# Altium schematic sheet DM2097_HUB.SchDoc: =project_title
size Tabloid; PageSetup: Record=PageOptions|CenterHorizontal=True|CenterVertical=True|PrintScale=0.73|XCorrection=1.00|YCorrection=1.00|PrintKind=0|BorderSize=5000000|LeftOffset=0|BottomOffset=0|Orientation=2|PaperLength=1000|PaperWidth=1000|Scale=100|PaperSource=7|PrintQuality=-4|MediaType=1|DitherType=10|PaperKind=A4|PrintScaleMode=1; CompanyName: Luxonis Holding; Organization: Luxonis Holding; Address1: 1925 Harmony Park Drive; Address2: Westminster, CO; Address3: 80234; Address4: United States; SheetNumber: 8; SheetTotal: 17
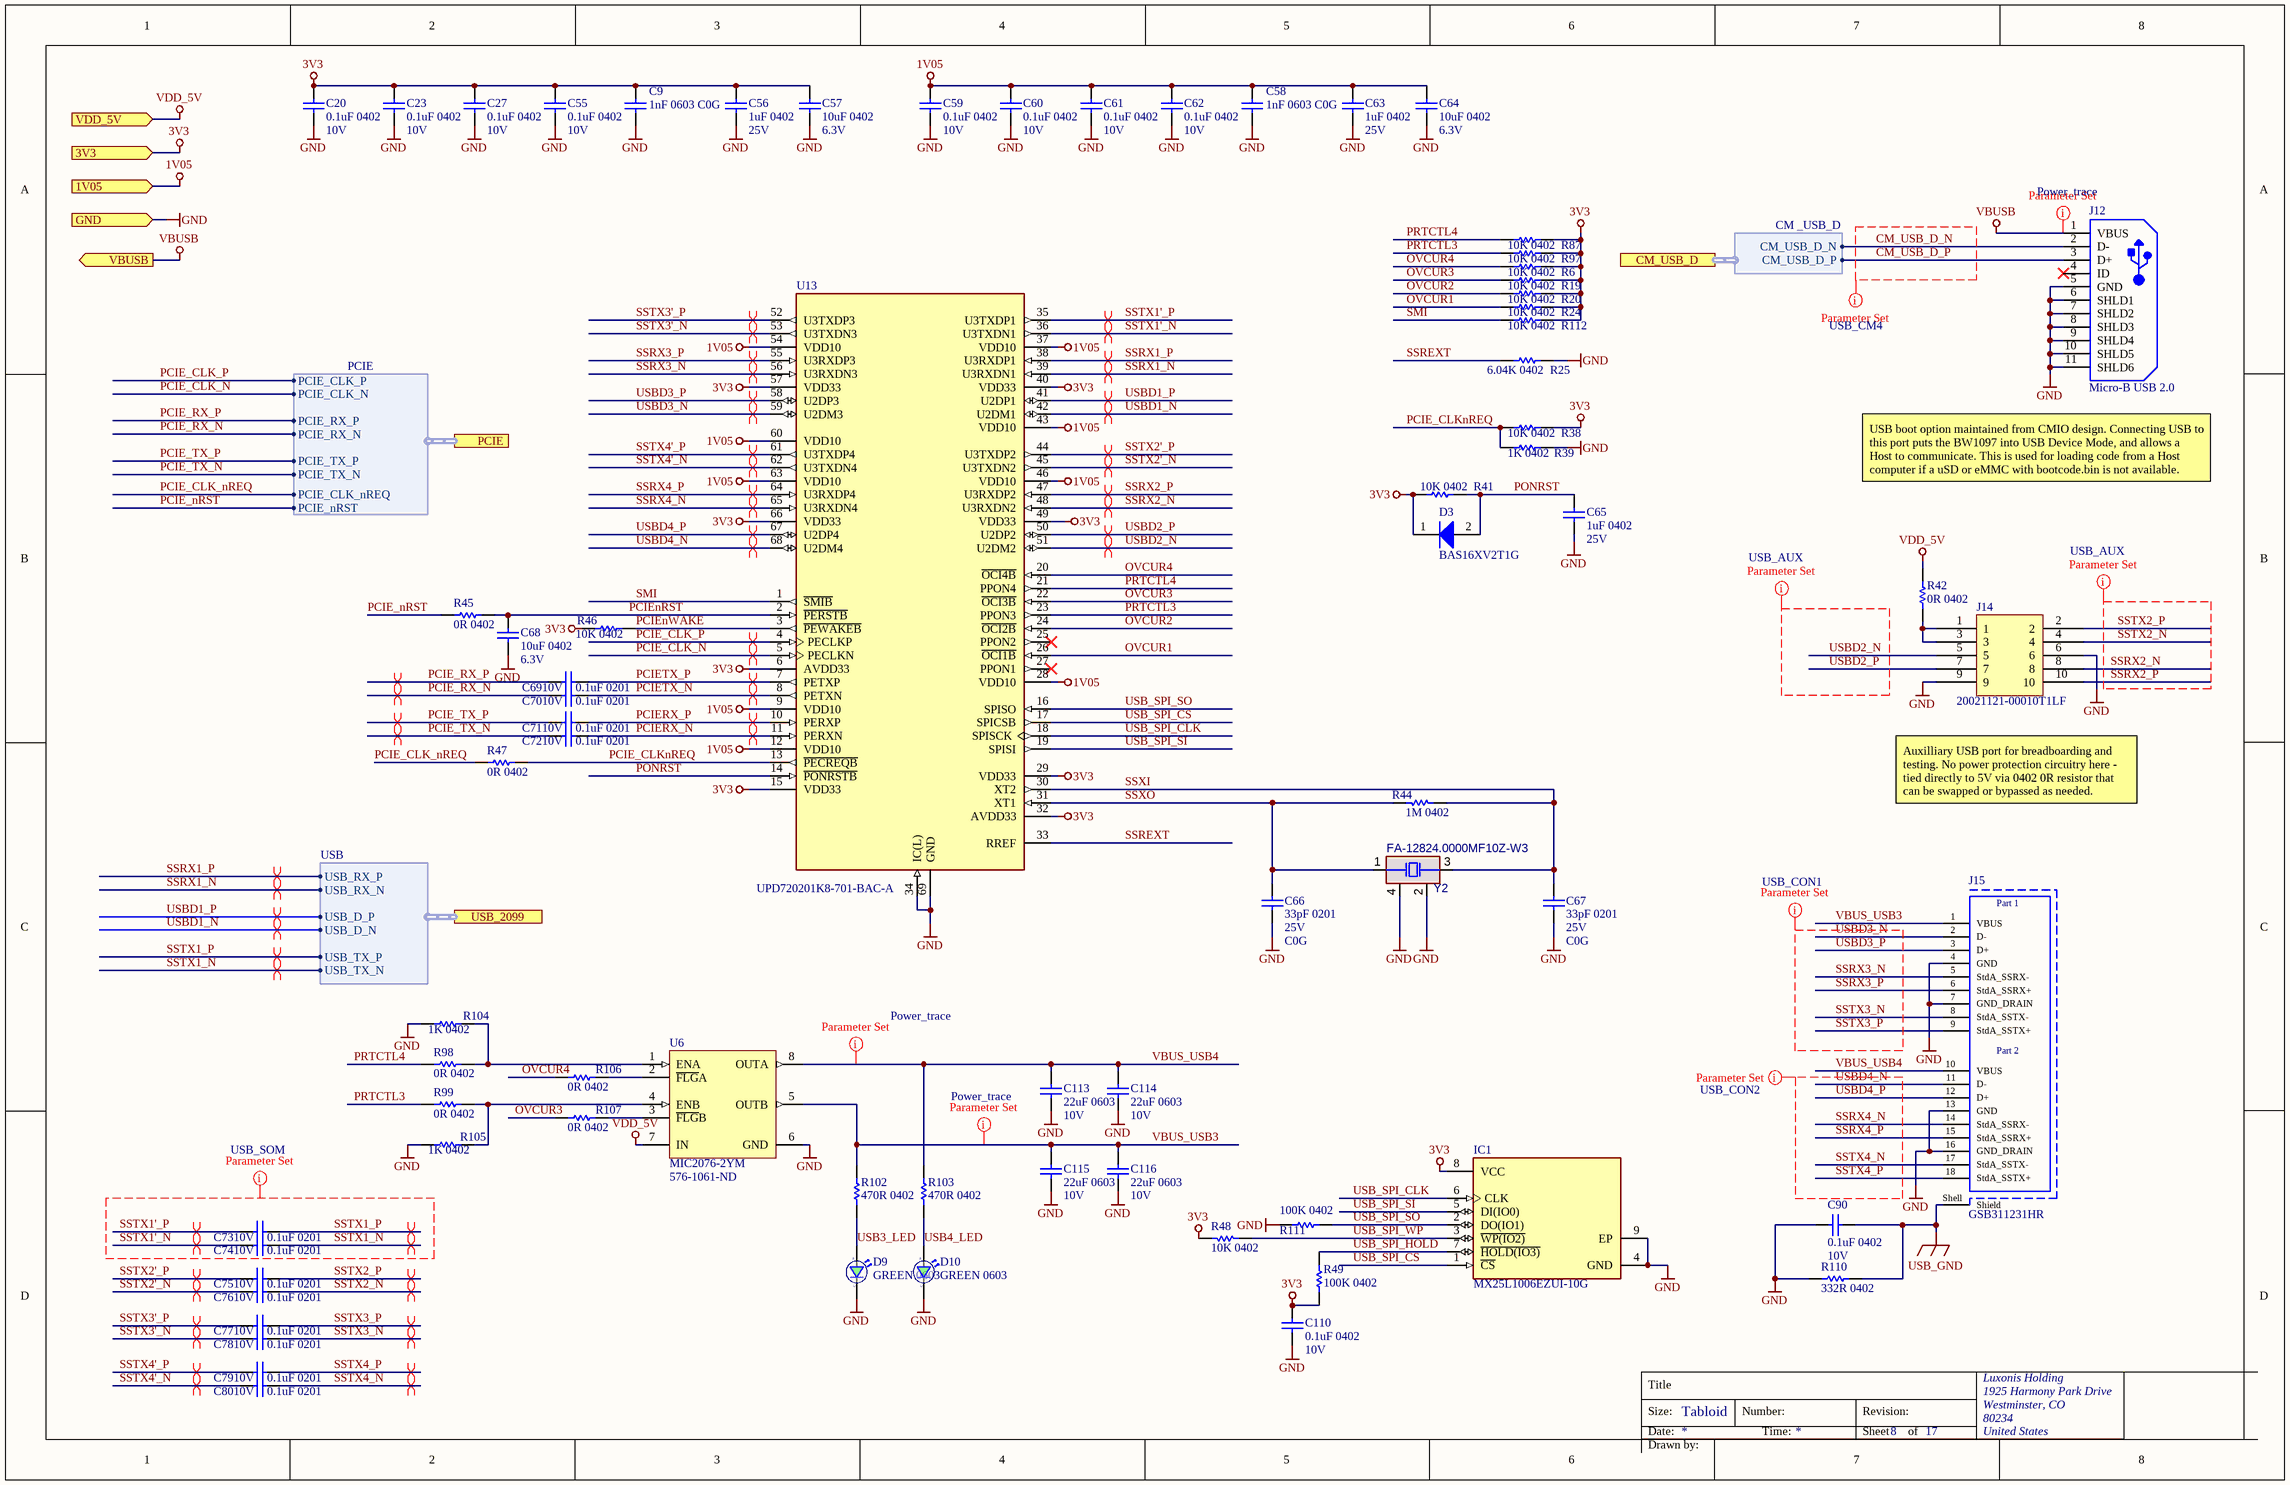
[diagram p0: DM2097_HUB.SchDoc]

## Parts
C9  1nF 0603 C0G  [CAPC0603(1608)100_N]
C20  0.1uF 0402  Voltage Rating: 10V  [CAPC0402(1005)70_N]
C23  0.1uF 0402  Voltage Rating: 10V  [CAPC0402(1005)70_N]
C27  0.1uF 0402  Voltage Rating: 10V  [CAPC0402(1005)70_N]
C55  0.1uF 0402  Voltage Rating: 10V  [CAPC0402(1005)70_N]
C56  1uF 0402  Voltage Rating: 25V  [CAPC0402(1005)70_N]
C57  10uF 0402  Voltage Rating: 6.3V  [CAPC0402(1005)70_N]
C58  1nF 0603 C0G  [CAPC0603(1608)100_N]
C59  0.1uF 0402  Voltage Rating: 10V  [CAPC0402(1005)70_N]
C60  0.1uF 0402  Voltage Rating: 10V  [CAPC0402(1005)70_N]
C61  0.1uF 0402  Voltage Rating: 10V  [CAPC0402(1005)70_N]
C62  0.1uF 0402  Voltage Rating: 10V  [CAPC0402(1005)70_N]
C63  1uF 0402  Voltage Rating: 25V  [CAPC0402(1005)70_N]
C64  10uF 0402  Voltage Rating: 6.3V  [CAPC0402(1005)70_N]
C65  1uF 0402  Voltage Rating: 25V  [CAPC0402(1005)70_N]
C66  33pF 0201  Voltage Rating: 25V  Dielectric: C0G  [CAPC0201(0603)33_L]
C67  33pF 0201  Voltage Rating: 25V  Dielectric: C0G  [CAPC0201(0603)33_L]
C68  10uF 0402  Voltage Rating: 6.3V  [CAPC0402(1005)70_N]
C69  0.1uF 0201  Voltage: 10V  [CAPC0201(0603)33_L]
C70  0.1uF 0201  Voltage: 10V  [CAPC0201(0603)33_L]
C71  0.1uF 0201  Voltage: 10V  [CAPC0201(0603)33_L]
C72  0.1uF 0201  Voltage: 10V  [CAPC0201(0603)33_L]
C73  0.1uF 0201  Voltage: 10V  [CAPC0201(0603)33_L]
C74  0.1uF 0201  Voltage: 10V  [CAPC0201(0603)33_L]
C75  0.1uF 0201  Voltage: 10V  [CAPC0201(0603)33_L]
C76  0.1uF 0201  Voltage: 10V  [CAPC0201(0603)33_L]
C77  0.1uF 0201  Voltage: 10V  [CAPC0201(0603)33_L]
C78  0.1uF 0201  Voltage: 10V  [CAPC0201(0603)33_L]
C79  0.1uF 0201  Voltage: 10V  [CAPC0201(0603)33_L]
C80  0.1uF 0201  Voltage: 10V  [CAPC0201(0603)33_L]
C90  0.1uF 0402  Voltage Rating: 10V  [CAPC0402(1005)70_N]
C110  0.1uF 0402  Voltage Rating: 10V  [CAPC0402(1005)70_N]
C113  22uF 0603  Voltage Rating: 10V  [CAPC0603(1608)100_N]
C114  22uF 0603  Voltage Rating: 10V  [CAPC0603(1608)100_N]
C115  22uF 0603  Voltage Rating: 10V  [CAPC0603(1608)100_N]
C116  22uF 0603  Voltage Rating: 10V  [CAPC0603(1608)100_N]
D3  BAS16XV2T1G  [BAS16XV2T1G]
D9  GREEN 0603  [SML_D1xx8W]
D10  GREEN 0603  [SML_D1xx8W]
IC1  MX25L1006EZUI-10G  [MX25L1006EZUI-10G-Footprint-1]
J12  Micro-B USB 2.0  [10118194-0001LF]
J14  20021121-00010T1LF  [20021121-00010T1LF]
J15  GSB311231HR  [GSB311231HR]
R6  10K 0402  [RESC0402(1005)_N]
R19  10K 0402  [RESC0402(1005)_N]
R20  10K 0402  [RESC0402(1005)_N]
R24  10K 0402  [RESC0402(1005)_N]
R25  6.04K 0402  [RESC0402(1005)_L]
R38  10K 0402  [RESC0402(1005)_N]
R39  1K 0402  [RESC0402(1005)_L]
R41  10K 0402  [RESC0402(1005)_N]
R42  0R 0402  [RESC0402(1005)_N]
R44  1M 0402  [RESC0402(1005)_N]
R45  0R 0402  [RESC0402(1005)_N]
R46  10K 0402  [RESC0402(1005)_N]
R47  0R 0402  [RESC0402(1005)_N]
R48  10K 0402  [RESC0402(1005)_N]
R49  100K 0402  [RESC0402(1005)_L]
R87  10K 0402  [RESC0402(1005)_N]
R97  10K 0402  [RESC0402(1005)_N]
R98  0R 0402  [RESC0402(1005)_N]
R99  0R 0402  [RESC0402(1005)_N]
R102  470R 0402  [RESC0402(1005)_N]
R103  470R 0402  [RESC0402(1005)_N]
R104  1K 0402  [RESC0402(1005)_L]
R105  1K 0402  [RESC0402(1005)_L]
R106  0R 0402  [RESC0402(1005)_N]
R107  0R 0402  [RESC0402(1005)_N]
R110  332R 0402  [RESC0402(1005)_N]
R111  100K 0402  [RESC0402(1005)_L]
R112  10K 0402  [RESC0402(1005)_N]
U6  MIC2076-2YM  Supplier Part Number 1: 576-1061-ND  [MIC2076-2YM]
U13  UPD720201K8-701-BAC-A  [QFN40P800X800X90-69N]
Y2  FA-12824.0000MF10Z-W3  [EPSON-FA-128_V]

## Ports
1V05 (in), 3V3 (in), CM_USB_D (harness CM _USB_D), GND (in), PCIE (harness PCIE), USB_2099 (harness USB), VBUSB (out), VDD_5V (in)

## Harnesses
CM _USB_D: CM_USB_D_P, CM_USB_D_N
PCIE: PCIE_CLK_P, PCIE_CLK_N, PCIE_RX_P, PCIE_RX_N, PCIE_TX_N, PCIE_TX_P, PCIE_CLK_nREQ, PCIE_nRST
USB: USB_D_P, USB_D_N, USB_TX_N, USB_TX_P, USB_RX_N, USB_RX_P

## Nets
1V05: C58.2 C59.2 C60.2 C61.2 C62.2 C63.2 C64.2 U13.9(VDD10) U13.12(VDD10) U13.28(VDD10) U13.37(VDD10) U13.43(VDD10) U13.46(VDD10) U13.54(VDD10) U13.60(VDD10) U13.63(VDD10) ; port 1V05
3V3: C9.2 C20.2 C23.2 C27.2 C55.2 C56.2 C57.2 C110.2 D3.1(K) IC1.8(VCC) R6.2 R19.2 R20.2 R24.2 R38.2 R41.1 R46.1 R48.2 R49.2 R87.2 R97.2 R112.2 U13.6(AVDD33) U13.15(VDD33) U13.29(VDD33) U13.32(AVDD33) U13.40(VDD33) U13.49(VDD33) U13.57(VDD33) U13.66(VDD33) ; port 3V3
GND: C9.1 C20.1 C23.1 C27.1 C55.1 C56.1 C57.1 C58.1 C59.1 C60.1 C61.1 C62.1 C63.1 C64.1 C65.1 C66.1 C67.1 C68.1 C90.1 C110.1 C113.2 C114.2 C115.2 C116.2 D9.1(C) D10.1(C) IC1.4(GND) IC1.9(EP) J12.5(GND) J12.6(SHLD1) J12.7(SHLD2) J12.8(SHLD3) J12.9(SHLD4) J12.10(SHLD5) J12.11(SHLD6) J14.6 J14.9 J15.4(GND) J15.7(GND_DRAIN) J15.13(GND) J15.16(GND_DRAIN) R25.2 R39.2 R104.1 R105.1 R110.1 R111.1 U6.6(GND) U13.34(IC(L)) U13.69(GND) Y2.2(NC) Y2.4(NC) ; port GND
USB_GND: C90.2 J15.Shell(Shield) R110.2
VBUSB: J12.1(VBUS) ; port VBUSB
VDD_5V: R42.2 U6.7(IN) ; port VDD_5V
CM_USB_D_N: J12.2(D-) ; port CM_USB_D.CM_USB_D_N
CM_USB_D_P: J12.3(D+) ; port CM_USB_D.CM_USB_D_P
OVCUR1: R24.1 U13.26(~{OCI1B})
OVCUR2: R20.1 U13.24(~{OCI2B})
OVCUR3: R19.1 R107.2 U13.22(~{OCI3B})
OVCUR4: R6.1 R106.2 U13.20(~{OCI4B})
PCIE_CLK_N: U13.5(PECLKN) ; port PCIE.PCIE_CLK_N
PCIE_CLK_nREQ: R47.1 ; port PCIE.PCIE_CLK_nREQ
PCIE_CLK_P: U13.4(PECLKP) ; port PCIE.PCIE_CLK_P
PCIE_CLKnREQ: R38.1 R39.1 R47.2 U13.13(~{PECREQB})
PCIE_nRST: R45.1 ; port PCIE.PCIE_nRST
PCIE_RX_N: C70.1 ; port PCIE.PCIE_RX_N
PCIE_RX_P: C69.1 ; port PCIE.PCIE_RX_P
PCIE_TX_N: C72.1 ; port PCIE.PCIE_TX_N
PCIE_TX_P: C71.1 ; port PCIE.PCIE_TX_P
PCIEnRST: C68.2 R45.2 U13.2(~{PERSTB})
PCIEnWAKE: R46.2 U13.3(~{PEWAKEB})
PCIERX_N: C72.2 U13.11(PERXN)
PCIERX_P: C71.2 U13.10(PERXP)
PCIETX_N: C70.2 U13.8(PETXN)
PCIETX_P: C69.2 U13.7(PETXP)
PONRST: C65.2 D3.2(A) R41.2 U13.14(~{PONRSTB})
PRTCTL3: R97.1 R99.2 U13.23(PPON3)
PRTCTL4: R87.1 R98.2 U13.21(PPON4)
SMI: R112.1 U13.1(~{SMIB})
SSREXT: R25.1 U13.33(RREF)
SSRX1_N: U13.39(U3RXDN1) ; port USB_2099.USB_RX_N
SSRX1_P: U13.38(U3RXDP1) ; port USB_2099.USB_RX_P
SSRX2_N: J14.8 U13.48(U3RXDN2)
SSRX2_P: J14.10 U13.47(U3RXDP2)
SSRX3_N: J15.5(StdA_SSRX-) U13.56(U3RXDN3)
SSRX3_P: J15.6(StdA_SSRX+) U13.55(U3RXDP3)
SSRX4_N: J15.14(StdA_SSRX-) U13.65(U3RXDN4)
SSRX4_P: J15.15(StdA_SSRX+) U13.64(U3RXDP4)
SSTX1'_N: C74.1 U13.36(U3TXDN1)
SSTX1'_P: C73.1 U13.35(U3TXDP1)
SSTX1_N: C74.2 ; port USB_2099.USB_TX_N
SSTX1_P: C73.2 ; port USB_2099.USB_TX_P
SSTX2'_N: C76.1 U13.45(U3TXDN2)
SSTX2'_P: C75.1 U13.44(U3TXDP2)
SSTX2_N: C76.2 J14.4
SSTX2_P: C75.2 J14.2
SSTX3'_N: C78.1 U13.53(U3TXDN3)
SSTX3'_P: C77.1 U13.52(U3TXDP3)
SSTX3_N: C78.2 J15.8(StdA_SSTX-)
SSTX3_P: C77.2 J15.9(StdA_SSTX+)
SSTX4'_N: C80.1 U13.62(U3TXDN4)
SSTX4'_P: C79.1 U13.61(U3TXDP4)
SSTX4_N: C80.2 J15.17(StdA_SSTX-)
SSTX4_P: C79.2 J15.18(StdA_SSTX+)
SSXI: C67.2 R44.1 U13.30(XT2) Y2.3(X2)
SSXO: C66.2 R44.2 U13.31(XT1) Y2.1(X1)
USB3_LED: D9.2(A) R102.1
USB4_LED: D10.2(A) R103.1
USB_SPI_CLK: IC1.6(CLK) U13.18(SPISCK)
USB_SPI_CS: IC1.1(~{CS}) U13.17(SPICSB)
USB_SPI_HOLD: IC1.7(~{HOLD(IO3)}) R49.1
USB_SPI_SI: IC1.5(DI(IO0)) U13.19(SPISI)
USB_SPI_SO: IC1.2(DO(IO1)) R111.2 U13.16(SPISO)
USB_SPI_WP: IC1.3(~{WP(IO2)}) R48.1
USBD1_N: U13.42(U2DM1) ; port USB_2099.USB_D_N
USBD1_P: U13.41(U2DP1) ; port USB_2099.USB_D_P
USBD2_N: J14.5 U13.51(U2DM2)
USBD2_P: J14.7 U13.50(U2DP2)
USBD3_N: J15.2(D-) U13.59(U2DM3)
USBD3_P: J15.3(D+) U13.58(U2DP3)
USBD4_N: J15.11(D-) U13.68(U2DM4)
USBD4_P: J15.12(D+) U13.67(U2DP4)
VBUS_USB3: C115.1 C116.1 J15.1(VBUS) R102.2 U6.5(OUTB)
VBUS_USB4: C113.1 C114.1 J15.10(VBUS) R103.2 U6.8(OUTA)
NetJ14_1: J14.1 J14.3 R42.1
NetR98_1: R98.1 R104.2 U6.1(ENA)
NetR99_1: R99.1 R105.2 U6.4(ENB)
NetR106_1: R106.1 U6.2(~{FLG}A)
NetR107_1: R107.1 U6.3(~{FLG}B)

Not connected (* = marked no-connect by the designer): J12 4(ID)*; U13 25(PPON2)* 27(PPON1)*

## Layout directives
net class Power_trace: VBUS_USB3, VBUS_USB4, VBUSB
differential pair; differential pair class 90ohm: SSRX1_N, SSRX1_P, SSRX2_N, SSRX2_P, SSRX3_N, SSRX3_P, SSRX4_N, SSRX4_P, SSTX1'_N, SSTX1'_P, SSTX1_N, SSTX1_P, SSTX2'_N, SSTX2'_P, SSTX2_N, SSTX2_P, SSTX3'_N, SSTX3'_P, SSTX3_N, SSTX3_P, SSTX4'_N, SSTX4'_P, SSTX4_N, SSTX4_P, USBD1_N, USBD1_P, USBD2_N, USBD2_P, USBD3_N, USBD3_P, USBD4_N, USBD4_P
differential pair; differential pair class 100ohm: PCIE_CLK_N, PCIE_CLK_P, PCIE_RX_N, PCIE_RX_P, PCIE_TX_N, PCIE_TX_P, PCIERX_N, PCIERX_P, PCIETX_N, PCIETX_P
net class USB_CON2: SSRX4_N, SSRX4_P, SSTX4_N, SSTX4_P, USBD4_N, USBD4_P
net class USB_CON1: SSRX3_N, SSRX3_P, SSTX3_N, SSTX3_P, USBD3_N, USBD3_P
net class USB_AUX: SSRX2_N, SSRX2_P, SSTX2_N, SSTX2_P, USBD2_N, USBD2_P
net class USB_CM4: CM_USB_D_N, CM_USB_D_P
net class USB_SOM: SSTX1'_N, SSTX1'_P, SSTX1_N, SSTX1_P

## Notes on the sheet
- (near J12) USB boot option maintained from CMIO design. Connecting USB to this port puts the BW1097 into USB Device Mode, and allows a Host to communicate. This is used for loading code from a Host computer if a uSD or eMMC with bootcode.bin is not available.
- Auxilliary USB port for breadboarding and testing. No power protection circuitry here - tied directly to 5V via 0402 0R resistor that can be swapped or bypassed as needed.
- Title
- Size:
- Date:
- Tabloid
- Number:
- Time:
- Revision:
- Sheet
- of
- Drawn by:
- (in symbol GSB311231HR) Part 1; Part 2

## Library data of the parts
C9 C58 = GRM1885C1H102FA01D: CAP CER 1000PF 50V C0G/NP0 0603; Manufacturer: Murata; Material: Ceramic; Tolerance: 1%; Temperature Coefficient: 30ppm/°C; Manufacturer Part Number: GRM1885C1H102FA01D; RoHS: Yes; Mount: Surface Mount; Number of Pins: 2; Case Code (Metric): 1608; Case Code (Imperial): 0603; Min Operating Temperature: -55°C; Max Operating Temperature: 125°C; Packaging: Tape and Reel; Package Quantity: 4000; Termination: SMD/SMT; Voltage Rating (DC): 50V; Voltage: 50V; Length: 1.6mm; Height: 0.8mm; Width: 0.031inch; Thickness: 0.035inch; Depth: 0.8mm; Radiation Hardening: No; REACH SVHC: No SVHC; Lead Free: Lead Free; ComponentLink1URL: https://datasheet.ciiva.com/6072/1747444-6072454.pdf?src-supplier=Farnell; ComponentLink1Description: https://datasheet.ciiva.com/6072/1747444-6072454.pdf?src-supplier=Farnell; ComponentLink2URL: https://datasheet.ciiva.com/7828/1747444-7828892.pdf?src-supplier=Element14; ComponentLink2Description: https://datasheet.ciiva.com/7828/1747444-7828892.pdf?src-supplier=Element14; ComponentLink3URL: https://datasheet.ciiva.com/11621/c02e-11621692.pdf?src-supplier=Avnet; ComponentLink3Description: https://datasheet.ciiva.com/11621/c02e-11621692.pdf?src-supplier=Avnet; ComponentLink4URL: https://datasheet.ciiva.com/16624/c02e-16624140.pdf?src-supplier=Avnet+Europe; ComponentLink4Description: https://datasheet.ciiva.com/16624/c02e-16624140.pdf?src-supplier=Avnet+Europe; ComponentLink5URL: https://datasheet.ciiva.com/22698/1747444-22698428.pdf?src-supplier=Element14; ComponentLink5Description: https://datasheet.ciiva.com/22698/1747444-22698428.pdf?src-supplier=Element14; ComponentLink6URL: https://datasheet.ciiva.com/5416/c02e-5416637.pdf?src-supplier=Mouser; ComponentLink6Description: https://datasheet.ciiva.com/5416/c02e-5416637.pdf?src-supplier=Mouser; ComponentLink7URL: https://datasheet.ciiva.com/6270/partnumbering-e-01-6270573.pdf?src-supplier=Digi-Key; ComponentLink7Description: https://datasheet.ciiva.com/6270/partnumbering-e-01-6270573.pdf?src-supplier=Digi-Key; ComponentLink8URL: https://datasheet.ciiva.com/6270/partnumbering-e-01-6270574.pdf?src-supplier=Digi-Key; ComponentLink8Description: https://datasheet.ciiva.com/6270/partnumbering-e-01-6270574.pdf?src-supplier=Digi-Key; ComponentLink9URL: https://datasheet.ciiva.com/6270/partnumbering-e-01-6270575.pdf?src-supplier=Digi-Key; ComponentLink9Description: https://datasheet.ciiva.com/6270/partnumbering-e-01-6270575.pdf?src-supplier=Digi-Key; ComponentLink10URL: https://datasheet.ciiva.com/16426/l0005e-16426367.pdf?src-supplier=Future+Electronics; ComponentLink10Description: https://datasheet.ciiva.com/16426/l0005e-16426367.pdf?src-supplier=Future+Electronics; Supplier 1: Digi-Key; Manufacturer 1: Murata; Manufacturer Part Number 1: GRM1885C1H102FA01D; Stock 1: 343900; Pricing 1: 1=0.19000, 10=0.13300, 100=0.06260, 500=0.04386, 1000=0.03631 (USD); Case/Package: 0603; Capacitance: 1nF; Dielectric: C0G; Voltage Rating: 50V; Supplier Part Number 1: 490-6376-1-ND
C20 C23 C27 C55 C59-C62 C90 C110 = GRM155R71A104JA01D: CAP CER 0.1UF 10V X7R 0402 5%; Manufacturer 1: Murata; Capacitance: 100nF; Supplier 1: Digi-Key; Manufacturer Part Number 1: GRM155R71A104JA01D; Stock 1: 1346709; Pricing 1: 1=0.10000, 10=0.02500, 100=0.01130, 500=0.00806, 1000=0.00633, 2500=0.00575, 5000=0.00529 (USD); RoHS: Yes; Mount: Surface Mount; Case/Package: 0402; Case Code (Imperial): 0402; Case Code (Metric): 1005; Min Operating Temperature: -55°C; Max Operating Temperature: 125°C; Tolerance: 5%; Packaging: Tape and Reel; Voltage Rating (DC): 10V; Dielectric: X7R; Package Quantity: 10000; Termination: SMD/SMT; Length: 1mm; Height: 0.5mm; Width: 0.02inch; Thickness: 0.022inch; Depth: 0.5mm; Radiation Hardening: No; Lead Free: Lead Free; ComponentLink1URL: https://datasheet.ciiva.com/5411/product-5411135.pdf?src-supplier=Mouser; ComponentLink1Description: https://datasheet.ciiva.com/5411/product-5411135.pdf?src-supplier=Mouser; ComponentLink2URL: https://datasheet.ciiva.com/11618/c02e-11618821.pdf?src-supplier=Avnet; ComponentLink2Description: https://datasheet.ciiva.com/11618/c02e-11618821.pdf?src-supplier=Avnet; Supplier Part Number 1: 490-10777-1-ND
C56 C63 C65 = GRM155R61E105KA12D: CAP CER 1UF 25V X5R 0402 10%; Manufacturer 1: Murata; Material: Ceramic; Supplier 1: Digi-Key; Manufacturer Part Number 1: GRM155R61E105KA12D; Stock 1: 200653; Pricing 1: 1=0.10000, 10=0.07100, 100=0.03350, 500=0.02352, 1000=0.01947, 2500=0.01812, 5000=0.01658 (USD); RoHS: Yes; Mount: Surface Mount; Case/Package: 0402; Weight: 0.000212oz; Case Code (Metric): 1005; Case Code (Imperial): 0402; Min Operating Temperature: -55°C; Max Operating Temperature: 85°C; Tolerance: 10%; Capacitance: 1uF; Dielectric: X5R; Voltage Rating (DC): 25V; Packaging: Tape and Reel; Package Quantity: 10000; Termination: SMD/SMT; Voltage: 25V; Length: 1mm; Height: 0.5mm; Width: 0.5mm; Thickness: 0.022inch; Depth: 0.5mm; Lead Free: Lead Free; REACH SVHC: No SVHC; ComponentLink1URL: https://datasheet.ciiva.com/22732/1666664-22732122.pdf?src-supplier=Element14; ComponentLink1Description: https://datasheet.ciiva.com/22732/1666664-22732122.pdf?src-supplier=Element14; ComponentLink2URL: https://datasheet.ciiva.com/7719/1666664-7719006.pdf?src-supplier=Element14; ComponentLink2Description: https://datasheet.ciiva.com/7719/1666664-7719006.pdf?src-supplier=Element14; Supplier Part Number 1: 490-10017-1-ND; Supplier 2: Arrow; Supplier 3: TTI; Supplier Part Number 2: GRM155R61E105KA12D; Supplier Part Number 3: GRM155R61E105KA12D
C57 C64 C68 = GRM155R60J106ME15D: CAP CER 10UF 6.3V X5R 0402 20%; Manufacturer 1: Murata; Supplier 1: Digi-Key; Manufacturer Part Number 1: GRM155R60J106ME15D; Stock 1: 1839627; Pricing 1: 1=0.23000, 10=0.15700, 100=0.07950, 500=0.05442, 1000=0.04814, 2500=0.04605, 5000=0.04186 (USD); RoHS: Yes; Mount: Surface Mount; Case/Package: 0402; Case Code (Metric): 1005; Case Code (Imperial): 0402; Min Operating Temperature: -55°C; Max Operating Temperature: 85°C; Packaging: Tape and Reel; Capacitance: 10uF; Dielectric: X5R; Length: 0.039inch; Width: 0.02inch; ComponentLink1URL: https://www.murata.com/~/media/webrenewal/support/library/catalog/products/capacitor/mlcc/c02e.ashx?la=en-us&src-supplier=Digi-Key; ComponentLink1Description: https://www.murata.com/~/media/webrenewal/support/library/catalog/products/capacitor/mlcc/c02e.ashx?la=en-us&src-supplier=Digi-Key; Supplier Part Number 1: 490-13238-1-ND; Voltage Rating (DC): 6.3V; Thickness: 0.026inch; Tolerance: 20%
C66 C67 = GRM0335C1E330JA01D: CAP CER 33PF 25V C0G/NP0 0201; Manufacturer 1: Murata; Tolerance: 5%; Manufacturer Part Number 1: GRM0335C1E330JA01D; Supplier 1: Digi-Key; Stock 1: 1107200; Pricing 1: 1=0.10000, 10=0.01500, 100=0.00680, 500=0.00484, 1000=0.00380, 2500=0.00345, 5000=0.00317 (USD); RoHS: Yes; Mount: Surface Mount; Case/Package: 0201; Case Code (Metric): 0603; Case Code (Imperial): 0201; Min Operating Temperature: -55°C; Max Operating Temperature: 125°C; Capacitance: 33pF; Packaging: Tape and Reel; Package Quantity: 15000; Voltage Rating (DC): 25V; Termination: SMD/SMT; Length: 0.6mm; Height: 0.3mm; Width: 0.012inch; Thickness: 0.013inch; Depth: 0.3mm; REACH SVHC: No SVHC; Lead Free: Lead Free; ComponentLink1URL: https://datasheet.ciiva.com/29538/partnumbering-e-01-29538933.pdf?src-supplier=Digi-Key; ComponentLink1Description: https://datasheet.ciiva.com/29538/partnumbering-e-01-29538933.pdf?src-supplier=Digi-Key; Supplier 2: Mouser; Supplier Part Number 2: 81-GRM0335C1E330JA1D; Supplier Part Number 1: 490-10678-1-ND
C69-C80 = GRM033R61A104KE15D: CAP CER 0.1UF 10V X5R 0201; Manufacturer 1: Murata; Capacitance: 100nF; Tolerance: 10%; Supplier 1: Digi-Key; Manufacturer Part Number 1: GRM033R61A104KE15D; Stock 1: 45335312; Pricing 1: 1=0.10000, 10=0.04200, 100=0.01860, 500=0.01330, 1000=0.01045, 2500=0.00950, 5000=0.00874 (USD); RoHS: Yes; Mount: Surface Mount; Case/Package: 0201; Weight: 6E-06oz; Case Code (Metric): 0603; Case Code (Imperial): 0201; Min Operating Temperature: -55°C; Max Operating Temperature: 85°C; Packaging: Tape and Reel; Voltage Rating: 10V; Package Quantity: 1; Voltage Rating (DC): 10V; Dielectric: X5R; Termination: SMD/SMT; Length: 0.6mm; Height: 0.3mm; Width: 0.012inch; Thickness: 0.013inch; Depth: 0.3mm; Radiation Hardening: No; Lead Free: Lead Free; REACH SVHC: No SVHC; ComponentLink1URL: https://datasheet.ciiva.com/26843/getdatasheetpartid-308656-26843739.pdf?src-supplier=Verical; ComponentLink1Description: https://datasheet.ciiva.com/26843/getdatasheetpartid-308656-26843739.pdf?src-supplier=Verical; ComponentLink2URL: https://datasheet.ciiva.com/5413/product-5413117.pdf?src-supplier=Mouser; ComponentLink2Description: https://datasheet.ciiva.com/5413/product-5413117.pdf?src-supplier=Mouser; ComponentLink3URL: https://datasheet.ciiva.com/6256/partnumbering-e-01-6256406.pdf?src-supplier=Digi-Key; ComponentLink3Description: https://datasheet.ciiva.com/6256/partnumbering-e-01-6256406.pdf?src-supplier=Digi-Key; ComponentLink4URL: https://datasheet.ciiva.com/6256/partnumbering-e-01-6256407.pdf?src-supplier=Digi-Key; ComponentLink4Description: https://datasheet.ciiva.com/6256/partnumbering-e-01-6256407.pdf?src-supplier=Digi-Key; ComponentLink5URL: https://datasheet.ciiva.com/6256/partnumbering-e-01-6256408.pdf?src-supplier=Digi-Key; ComponentLink5Description: https://datasheet.ciiva.com/6256/partnumbering-e-01-6256408.pdf?src-supplier=Digi-Key; Supplier Part Number 1: 490-5881-1-ND
C113-C116 = GRM188R61A226ME15D: CAP CER 22UF 10V X5R 0603 20%; Manufacturer 1: Murata; Material: Ceramic; Manufacturer Part Number 1: GRM188R61A226ME15D; ComponentLink1URL: https://datasheet.ciiva.com/46444/1769893-46444975.pdf?src-supplier=Element14; ComponentLink1Description: https://datasheet.ciiva.com/46444/1769893-46444975.pdf?src-supplier=Element14; Supplier 1: Digi-Key; Stock 1: 984716; Pricing 1: 1=0.31000, 10=0.21500, 100=0.12160, 500=0.08584, 1000=0.07512 (USD); RoHS: Yes; Mount: Surface Mount; Case/Package: 0603; Weight: 0.000222oz; Case Code (Metric): 1608; Case Code (Imperial): 0603; Min Operating Temperature: -55°C; Max Operating Temperature: 85°C; Capacitance: 22uF; Tolerance: 20%; Packaging: Tape and Reel; Dielectric: X5R; Voltage Rating (DC): 10V; Termination: SMD/SMT; Package Quantity: 4000; Length: 1.6mm; Height: 0.8mm; Width: 0.8mm; Thickness: 0.039inch; Depth: 0.8mm; REACH SVHC: No SVHC; Lead Free: Lead Free; Supplier Part Number 1: 490-10476-1-ND
D3 = CMP-004-00003-1: DIODE GEN PURP 75V 200MA SOD523; Manufacturer 1: ON Semiconductor; Max Surge Current: 500mA; Element Configuration: Single; Capacitance: 2pF; Power Dissipation: 200mW; Peak Reverse Current: 1uA; Reverse Recovery Time: 6ns; Forward Voltage: 1.25V; Polarity: Standard; ComponentLink6URL: https://datasheet.ciiva.com/16475/bas16xv2t1-d-16475723.pdf?src-supplier=Avnet+Asia; ComponentLink5Description: https://datasheet.ciiva.com/15144/getdatasheetpartid-84399-15144565.pdf?src-supplier=Verical; Stock 2: 246371; Peak Non-Repetitive Surge Current: 500mA; ComponentLink6Description: https://datasheet.ciiva.com/16475/bas16xv2t1-d-16475723.pdf?src-supplier=Avnet+Asia; ComponentLink3Description: https://datasheet.ciiva.com/22663/1708232-22663646.pdf?src-supplier=Element14; Contact Plating: Tin,Matte; Length: 1.3mm; Manufacturer Part Number 1: BAS16XV2T1G; Packaging: Tape and Reel; Stock 1: 246371; Lead Free: Lead Free; Width: 0.9mm; Max Forward Surge Current (Ifsm): 500mA; Halogen Free: Halogen Free; ComponentLink4Description: https://datasheet.ciiva.com/36525/806485-36525908.pdf?src-supplier=Jameco; Source: LuxonisMaster.SchLib; Package Quantity: 1; ComponentLink3URL: https://datasheet.ciiva.com/22663/1708232-22663646.pdf?src-supplier=Element14; Output Current: 200mA; Case/Package: SOD-523-2; Height: 0.7mm; ComponentLink5URL: https://datasheet.ciiva.com/15144/getdatasheetpartid-84399-15144565.pdf?src-supplier=Verical; Min Operating Temperature: -55°C; REACH SVHC: No SVHC; ComponentLink4URL: https://datasheet.ciiva.com/36525/806485-36525908.pdf?src-supplier=Jameco; Radiation Hardening: No; Max Reverse Voltage (DC): 75V; ComponentLink7Description: https://datasheet.ciiva.com/25930/bas16xv2t1-d-25930683.pdf?src-supplier=Avnet+Europe; Design Item ID: BAS16XV2T1G; Max Operating Temperature: 150°C; ComponentLink2URL: https://datasheet.ciiva.com/4434/bas16xv2t1-d-103464-4434928.pdf?src-supplier=Mouser; Forward Current: 200mA; Max Reverse Leakage Current: 1uA; Average Rectified Current: 200mA; ComponentLink1Description: https://datasheet.ciiva.com/915/bas16xv2t1-d-915360.pdf?src-supplier=Digi-Key; Pins: 2; Manufacturer Part Number 2: BAS16XV2T1G; Max Repetitive Reverse Voltage (Vrrm): 75V; ComponentLink2Description: https://datasheet.ciiva.com/4434/bas16xv2t1-d-103464-4434928.pdf?src-supplier=Mouser; ComponentLink7URL: https://datasheet.ciiva.com/25930/bas16xv2t1-d-25930683.pdf?src-supplier=Avnet+Europe; Pricing 2: 1=0.13000, 10=0.11600, 100=0.06330, 500=0.03898, 1000=0.02658 (USD); ComponentLink1URL: https://datasheet.ciiva.com/915/bas16xv2t1-d-915360.pdf?src-supplier=Digi-Key; Recovery Time: 6ns; Manufacturer 2: ON Semiconductor; Pricing 1: 1=0.13000, 10=0.11600, 100=0.06330, 500=0.03898, 1000=0.02658 (USD); RoHS: Yes
D9 D10 = SML-D12M8WT86: LED GREEN DIFFUSED 0603 SMD Green 572nm LED Indication - Discrete 2.2V 0603 (1608 Metric); Manufacturer: Rohm; Colour: Green,Yellow; Lens Colour: White,Clear,Diffused; Lens Style: Diffused,Colorless,Rectangular; Forward Current: 20mA; Luminous Intensity: 25mcd; Number of LEDs: 1; Viewing Angle: 160°; Lens Color: White,Diffused; Supplier 1: Digi-Key; Manufacturer Part Number: SML-D12M8WT86; Stock 1: 112971; Pricing 1: 1=0.33000, 10=0.23900, 100=0.11340, 500=0.07560, 1000=0.05922 (USD); Mount: Surface Mount; Case/Package: 0603; Number of Pins: 2; Case Code (Metric): 1608; Case Code (Imperial): 0603; Min Operating Temperature: -40°C; Max Operating Temperature: 85°C; Forward Voltage: 2.2V; Packaging: Tape and Reel; Dominant Wavelength: 572nm; Wavelength: 572nm; Illumination Colour: Green; Package Quantity: 1; Test Current: 20mA; Lens Transparency: Diffused; Length: 1.6mm; Height: 0.65mm; Width: 0.8mm; Radiation Hardening: No; REACH SVHC: Unknown; Lead Free: Lead Free; ComponentLink1URL: https://datasheet.ciiva.com/11774/0900766b80df3ada-11774260.pdf; ComponentLink1Description: https://datasheet.ciiva.com/11774/0900766b80df3ada-11774260.pdf; ComponentLink2URL: https://datasheet.ciiva.com/3161/sml-d1-3161419.pdf; ComponentLink2Description: https://datasheet.ciiva.com/3161/sml-d1-3161419.pdf; ComponentLink3URL: https://datasheet.ciiva.com/2110/sml-d1-2110396.pdf; ComponentLink3Description: https://datasheet.ciiva.com/2110/sml-d1-2110396.pdf; ComponentLink4URL: https://datasheet.ciiva.com/2110/sml-d1-2110397.pdf; ComponentLink4Description: https://datasheet.ciiva.com/2110/sml-d1-2110397.pdf; ComponentLink5URL: https://datasheet.ciiva.com/2110/sml-d1-2110398.pdf; ComponentLink5Description: https://datasheet.ciiva.com/2110/sml-d1-2110398.pdf; Manufacturer 1: Rohm; Manufacturer Part Number 1: SML-D12M8WT86; RoHS: Yes; Color: Green,Yellow; Illumination Color: Green; ComponentLink6URL: https://datasheet.ciiva.com/11774/0900766b80df3ada-11774260.pdf?src-supplier=RSComponents; ComponentLink6Description: https://datasheet.ciiva.com/11774/0900766b80df3ada-11774260.pdf?src-supplier=RSComponents; ComponentLink7URL: https://datasheet.ciiva.com/3161/sml-d1-3161419.pdf?src-supplier=Avnet; ComponentLink7Description: https://datasheet.ciiva.com/3161/sml-d1-3161419.pdf?src-supplier=Avnet; ComponentLink8URL: https://datasheet.ciiva.com/2110/sml-d1-2110396.pdf?src-supplier=Digi-Key; ComponentLink8Description: https://datasheet.ciiva.com/2110/sml-d1-2110396.pdf?src-supplier=Digi-Key; ComponentLink9URL: https://datasheet.ciiva.com/2110/sml-d1-2110397.pdf?src-supplier=Digi-Key; ComponentLink9Description: https://datasheet.ciiva.com/2110/sml-d1-2110397.pdf?src-supplier=Digi-Key; ComponentLink10URL: https://datasheet.ciiva.com/2110/sml-d1-2110398.pdf?src-supplier=Digi-Key; ComponentLink10Description: https://datasheet.ciiva.com/2110/sml-d1-2110398.pdf?src-supplier=Digi-Key; Supplier Part Number 1: 511-1578-1-ND
IC1 = CMP-031-00009-2: Flash, 512KX2, PDSO8; Manufacturer 1: Macronix; RoHS Compliant: Yes; Min Operating Temperature: -40°C; Manufacturer Part Number 1: MX25L1006EZUI-10G; Pins: 8; Case/Package: 8-USON; Mounting Technology: SMD; Max Operating Temperature: 85°C
J12 = 10118194-0001LF: CONN RCPT USB2.0 MICRO B SMD R/A USB - micro B USB 2.0 Receptacle Connector 5 Position Surface Mount, Right Angle; Through Hole; Manufacturer 1: Amphenol FCI; Current Rating: 1.8A; Connector Type: USB,Receptacle; Number of Contacts: 5; Insulation Resistance: 1GR; Number of Ports: 1; Max Voltage Rating (AC): 100V; Pitch: 0.65mm; Manufacturer Part Number 1: 10118194-0001LF; ComponentLink1URL: https://datasheet.ciiva.com/4598/10118194ac-197217-4598807.pdf?src-supplier=Mouser; ComponentLink1Description: https://datasheet.ciiva.com/4598/10118194ac-197217-4598807.pdf?src-supplier=Mouser; ComponentLink2URL: https://datasheet.ciiva.com/26945/getdatasheetpartid-418619-26945695.pdf?src-supplier=Verical; ComponentLink2Description: https://datasheet.ciiva.com/26945/getdatasheetpartid-418619-26945695.pdf?src-supplier=Verical; ComponentLink3URL: https://datasheet.ciiva.com/851/10118194-851110.pdf?src-supplier=Digi-Key; ComponentLink3Description: https://datasheet.ciiva.com/851/10118194-851110.pdf?src-supplier=Digi-Key; ComponentLink4URL: https://datasheet.ciiva.com/851/10118194-851111.pdf?src-supplier=Digi-Key; ComponentLink4Description: https://datasheet.ciiva.com/851/10118194-851111.pdf?src-supplier=Digi-Key; Supplier 1: Digi-Key; Stock 1: 69726; Pricing 1: 1=0.43000, 10=0.40500, 25=0.36440, 50=0.32400, 100=0.31040, 250=0.28344, 500=0.26994 (USD); RoHS: Yes; Mount: Surface Mount,Horizontal; Color: Black; Contact Material: Copper Alloy; Contact Plating: Gold; Number of Terminals: 5; Housing Material: Polymer; Min Operating Temperature: -55°C; Max Operating Temperature: 85°C; Package Quantity: 9600; Packaging: Tape and Reel; Gender: Receptacle; Termination: Solder; Orientation: Right Angle; Features: Shielded; Length: 8.05mm; Depth: 5mm; Radiation Hardening: No; Lead Free: Lead Free; Flammability Rating: UL94 V-0; Supplier Part Number 1: 609-4618-1-ND
J14 = 20021121-00010T1LF: CONN HEADER SMD 10POS 1.27MM; Manufacturer 1: Amphenol FCI; Number of Contacts: 10; Contact Resistance: 30mR; Max Voltage Rating (AC): 125V; Connector Type: Male Pin; Row Spacing: 0.05inch; Supplier 1: Digi-Key; Manufacturer Part Number 1: 20021121-00010T1LF; Stock 1: 1465; Pricing 1: 1=0.77000, 10=0.71800, 100=0.55040, 500=0.47860, 1000=0.39485, 5000=0.34699, 10000=0.32306 (USD); RoHS: Yes; Mount: Surface Mount; Contact Plating: Gold; Color: Black; Contact Material: Copper Alloy; Housing Color: Black; Housing Material: Thermoplastic; Min Operating Temperature: -40°C; Max Operating Temperature: 85°C; Number of Rows: 2; Termination: Solder; Package Quantity: 93; Packaging: Rail/Tube; Number of Positions: 10; Orientation: Straight; Length: 6.35mm; Pitch: 1.27mm; Contact Mating Length: 0.12inch; Depth: 3.4mm; ComponentLink1URL: https://datasheet.ciiva.com/18659/20021121-18659066.pdf?src-supplier=Digi-Key; ComponentLink1Description: https://datasheet.ciiva.com/18659/20021121-18659066.pdf?src-supplier=Digi-Key; ComponentLink2URL: https://datasheet.ciiva.com/10033/20021121-10033582.pdf?src-supplier=Avnet; ComponentLink2Description: https://datasheet.ciiva.com/10033/20021121-10033582.pdf?src-supplier=Avnet; Supplier Part Number 1: 609-6529-ND; Supplier 2: Mouser; Supplier 3: TTI; Supplier Part Number 2: 649-200211210010T1LF; Supplier Part Number 3: 20021121-00010T1LF
J15 = GSB311231HR: USB Connector, 18 Contact(s), Female, Right Angle, Solder Terminal; Manufacturer 1: Amphenol ICC; Manufacturer: Amphenol Commercial; Manufacturer Part Number 1: GSB311231HR; Manufacturer Part Number: GSB311231HR; Component Type: Connectors
R6 R19 R20 R24 R38 R41 R46 R48 R87 R97 R112 = RC0402FR-1310KL: RES SMD 10K OHM 1% 0402 1/16W Chip Resistor, 0402 [1005 Metric], 10 kohm, RC Series, 50 V, Thick Film, 62.5 mW; Manufacturer 1: Yageo; Resistance: 10kR; Temperature Coefficient: 100ppm/°C; Power Rating: 62.5mW; Voltage Rating: 50V; Manufacturer Part Number 1: RC0402FR-1310KL; ComponentLink1URL: https://datasheet.ciiva.com/16940/pyu-rc0402-51-rohs-l-6-16940293.pdf?src-supplier=Avnet+Europe; ComponentLink1Description: https://datasheet.ciiva.com/16940/pyu-rc0402-51-rohs-l-6-16940293.pdf?src-supplier=Avnet+Europe; ComponentLink2URL: https://datasheet.ciiva.com/28386/pyu-rc0402-51-rohs-l-6-28386855.pdf?src-supplier=Avnet+Europe; ComponentLink2Description: https://datasheet.ciiva.com/28386/pyu-rc0402-51-rohs-l-6-28386855.pdf?src-supplier=Avnet+Europe; ComponentLink3URL: https://datasheet.ciiva.com/16740/pyu-rc0402-51-rohs-l-6-r-16740602.pdf?src-supplier=Future+Electronics; ComponentLink3Description: https://datasheet.ciiva.com/16740/pyu-rc0402-51-rohs-l-6-r-16740602.pdf?src-supplier=Future+Electronics; ComponentLink4URL: https://datasheet.ciiva.com/8891/pyu-rc0402-51-rohs-l-6-8891339.pdf?src-supplier=Avnet; ComponentLink4Description: https://datasheet.ciiva.com/8891/pyu-rc0402-51-rohs-l-6-8891339.pdf?src-supplier=Avnet; ComponentLink5URL: https://datasheet.ciiva.com/5557/pyu-rc0402-51-rohs-l-6-r-5557997.pdf?src-supplier=Mouser; ComponentLink5Description: https://datasheet.ciiva.com/5557/pyu-rc0402-51-rohs-l-6-r-5557997.pdf?src-supplier=Mouser; ComponentLink6URL: https://datasheet.ciiva.com/7983/1018594-7983533.pdf?src-supplier=Element14; ComponentLink6Description: https://datasheet.ciiva.com/7983/1018594-7983533.pdf?src-supplier=Element14; Supplier 1: Newark; Stock 1: 62239; Pricing 1: 1=0.10000, 25=0.01200, 100=0.00400, 250=0.00400, 500=0.00300, 1000=0.00300 (USD); RoHS: Yes; Case/Package: 0402; Number of Pins: 2; Contact Plating: Tin,Matte,Lead; Case Code (Imperial): 0402; Case Code (Metric): 1005; Min Operating Temperature: -55°C; Max Operating Temperature: 155°C; Tolerance: 1%; Composition: Thick Film; Packaging: Tape and Reel; Termination: SMD/SMT; Military Standard: Not; Voltage Rating (DC): 50V; Working Voltage: 50V; Number of Terminations: 2; Length: 1mm; Depth: 0.5mm; Radiation Hardening: No; REACH SVHC: No SVHC; Lead Free: Lead Free; Supplier Part Number 1: 67R9960; Supplier 2: Future Electronics; Supplier 3: Mouser; Supplier 4: Element14; Supplier Part Number 2: RC0402FR-1310KL-CUTT; Supplier Part Number 3: 603-RC0402FR-1310KL; Supplier Part Number 4: 1799235
R25 = CMP-009-00051-1: Fixed Resistor, Metal Glaze/thick Film, 0.063W, 6040ohm, 50V, 1% +/-Tol, 100ppm/Cel, Surface Mount, 0402; Manufacturer Part Number 1: CRCW04026K04FKED; Manufacturer 1: Vishay; Package Width: 0.5mm; Temperature Coefficient: 100ppm/°C; Resistance: 6.04kR; Rated Power Dissipation (P): 63mW; Package Height: 0.35mm; Package Length: 1mm; Reference Standard: AEC-Q200; Rated Temperature: 70°C; Max Operating Temperature: 155°C; Package Shape: Rectangular; Size Code: 0402; Terminal Finish: Nickel; Packaging: Tape and Reel; REACH SVHC: Yes; Resistor Type: FIXED RESISTOR; Termination: Wraparound; Number of Pins: 2; Technology: METAL GLAZE/THICK FILM; Min Operating Temperature: -55°C; Working Voltage: 50V; RoHS Compliant: Yes; JESD-609 Code: e3; Package Style: SMTMeter; Mount: Surface Mount; Construction: Chip; Tolerance: 1%
R39 R104 R105 = CMP-009-00003-1: RES SMD 1K OHM 1% 1/16W 0402 1 kOhms ±1% 0.063W, 1/16W Chip Resistor 0402 (1005 Metric) Moisture Resistant Thick Film; Manufacturer Part Number 1: RC0402FR-071KL; Manufacturer 1: Yageo; Temperature Coefficient: 100ppm/°C; Power Rating: 62.5mW; Voltage Rating (DC): 50V; Lead Free: Lead Free; Length: 1mm; ComponentLink3URL: https://datasheet.ciiva.com/17063/pyu-rc0402-51-rohs-l-6-r-17063193.pdf?src-supplier=Future+Electronics; ComponentLink6Description: https://datasheet.ciiva.com/7983/1018594-7983502.pdf?src-supplier=Element14; ComponentLink5URL: https://datasheet.ciiva.com/7849/1018594-7849869.pdf?src-supplier=Element14; ComponentLink6URL: https://datasheet.ciiva.com/7983/1018594-7983502.pdf?src-supplier=Element14; ComponentLink5Description: https://datasheet.ciiva.com/7849/1018594-7849869.pdf?src-supplier=Element14; ComponentLink1URL: https://datasheet.ciiva.com/11819/0900766b80c66297-11819477.pdf?src-supplier=RSComponents; REACH SVHC: Unknown; Tolerance: 1%; Termination: SMD/SMT; ComponentLink4Description: https://datasheet.ciiva.com/22747/1018594-22747513.pdf?src-supplier=Element14; ComponentLink3Description: https://datasheet.ciiva.com/17063/pyu-rc0402-51-rohs-l-6-r-17063193.pdf?src-supplier=Future+Electronics; Height: 0.32mm; ComponentLink7URL: https://datasheet.ciiva.com/7849/1018594-7849871.pdf?src-supplier=Element14; Source: LuxonisMaster.SchLib; ComponentLink4URL: https://datasheet.ciiva.com/22747/1018594-22747513.pdf?src-supplier=Element14; Max Operating Temperature: 155°C; Depth: 0.5mm; ComponentLink1Description: https://datasheet.ciiva.com/11819/0900766b80c66297-11819477.pdf?src-supplier=RSComponents; Case Code (Metric): 1005; ComponentLink2URL: https://datasheet.ciiva.com/12666/pyu-rc0402-51-rohs-l-6-r-12666741.pdf?src-supplier=Mouser; Composition: Thick Film; ComponentLink2Description: https://datasheet.ciiva.com/12666/pyu-rc0402-51-rohs-l-6-r-12666741.pdf?src-supplier=Mouser; Packaging: Tape and Reel; Stock 1: 60695854; Pins: 2; Military Standard: Not; Width: 0.5mm; RoHS: Yes; Min Operating Temperature: -55°C; Voltage Rating: 50V; Pricing 1: 1=0.10000, 10=0.01600, 100=0.00670, 1000=0.00301, 2500=0.00261, 5000=0.00215 (USD); Case/Package: 0402; Design Item ID: RC0402FR-071KL; ComponentLink7Description: https://datasheet.ciiva.com/7849/1018594-7849871.pdf?src-supplier=Element14; Value: 1k
R42 R45 R47 R98 R99 R106 R107 = CRCW04020000Z0ED: RES SMD 0 OHM JUMPER 1/16W 0402; Manufacturer 1: Vishay; Resistance: 0mR; Power Rating: 63mW; Voltage Rating: 50V; Temperature Coefficient: 100ppm/°C; Tolerance: 5%; Manufacturer Part Number 1: CRCW04020000Z0ED; Supplier 1: Digi-Key; Stock 1: 855968; Pricing 1: 1=0.10000, 10=0.03400, 25=0.02440, 50=0.01860, 100=0.01380, 250=0.01048, 500=0.00840, 1000=0.00618, 5000=0.00443 (USD); RoHS: Yes; Mount: Surface Mount; Case/Package: 0402; Weight: 2.3E-05oz; Case Code (Imperial): 0402; Case Code (Metric): 1005; Contact Plating: Tin; Min Operating Temperature: -55°C; Max Operating Temperature: 155°C; Packaging: Tape and Reel; Composition: Thick Film; Voltage Rating (DC): 50V; Package Quantity: 1; Termination: SMD/SMT; Number of Terminations: 2; Military Standard: Not; Max Power Dissipation: 63mW; Features: Automotive AEC-Q200; Length: 1mm; Height: 0.35mm; Width: 0.5mm; Depth: 0.5mm; Radiation Hardening: No; REACH SVHC: Unknown; Lead Free: Lead Free; ComponentLink1URL: https://datasheet.ciiva.com/3255/dcrcwe3-3255944.pdf?src-supplier=Avnet; ComponentLink1Description: https://datasheet.ciiva.com/3255/dcrcwe3-3255944.pdf?src-supplier=Avnet; ComponentLink2URL: https://datasheet.ciiva.com/3255/dcrcwe3-3255945.pdf?src-supplier=Avnet; ComponentLink2Description: https://datasheet.ciiva.com/3255/dcrcwe3-3255945.pdf?src-supplier=Avnet; ComponentLink3URL: https://datasheet.ciiva.com/16881/dcrcwe3-16881413.pdf?src-supplier=Avnet+Europe; ComponentLink3Description: https://datasheet.ciiva.com/16881/dcrcwe3-16881413.pdf?src-supplier=Avnet+Europe; ComponentLink4URL: https://datasheet.ciiva.com/2461/dcrcwe3-2461962.pdf?src-supplier=Digi-Key; ComponentLink4Description: https://datasheet.ciiva.com/2461/dcrcwe3-2461962.pdf?src-supplier=Digi-Key; ComponentLink5URL: https://datasheet.ciiva.com/7841/1720486-7841802.pdf?src-supplier=Element14; ComponentLink5Description: https://datasheet.ciiva.com/7841/1720486-7841802.pdf?src-supplier=Element14; ComponentLink6URL: https://datasheet.ciiva.com/2461/dcrcwe3-2461963.pdf?src-supplier=Digi-Key; ComponentLink6Description: https://datasheet.ciiva.com/2461/dcrcwe3-2461963.pdf?src-supplier=Digi-Key; ComponentLink7URL: https://datasheet.ciiva.com/2461/dcrcwe3-2461964.pdf?src-supplier=Digi-Key; ComponentLink7Description: https://datasheet.ciiva.com/2461/dcrcwe3-2461964.pdf?src-supplier=Digi-Key; ComponentLink8URL: https://datasheet.ciiva.com/7841/1697337-7841468.pdf?src-supplier=Element14; ComponentLink8Description: https://datasheet.ciiva.com/7841/1697337-7841468.pdf?src-supplier=Element14; ComponentLink9URL: https://datasheet.ciiva.com/16761/70200976-16761309.pdf?src-supplier=Allied+Electronics; ComponentLink9Description: https://datasheet.ciiva.com/16761/70200976-16761309.pdf?src-supplier=Allied+Electronics; ComponentLink10URL: https://datasheet.ciiva.com/26311/fld-crcw-e3-data-en-26311550.pdf?src-supplier=Distrelec; ComponentLink10Description: https://datasheet.ciiva.com/26311/fld-crcw-e3-data-en-26311550.pdf?src-supplier=Distrelec; Supplier Part Number 1: 541-0.0JCT-ND
R44 = RC0402FR-071ML: RES SMD 1M OHM 1% 1/16W 0402; Manufacturer 1: Yageo; Resistance: 1MR; Temperature Coefficient: 100ppm/°C; Power Rating: 63mW; Voltage Rating: 50V; Manufacturer Part Number 1: RC0402FR-071ML; Supplier 1: Digi-Key; Stock 1: 11406681; Pricing 1: 1=0.10000, 10=0.01500, 100=0.00600, 1000=0.00268, 2500=0.00232, 5000=0.00192 (USD); RoHS: Yes; Case/Package: 0402; Case Code (Imperial): 0402; Case Code (Metric): 1005; Min Operating Temperature: -55°C; Max Operating Temperature: 155°C; Packaging: Tape and Reel; Tolerance: 1%; Composition: Thick Film; Military Standard: Not; Termination: SMD/SMT; Length: 1mm; Height: 0.32mm; Depth: 0.5mm; Lead Free: Lead Free; REACH SVHC: Unknown; ComponentLink1URL: https://datasheet.ciiva.com/11808/0900766b80c66297-11808125.pdf?src-supplier=RSComponents; ComponentLink1Description: https://datasheet.ciiva.com/11808/0900766b80c66297-11808125.pdf?src-supplier=RSComponents; ComponentLink2URL: https://datasheet.ciiva.com/46394/1018594-46394951.pdf?src-supplier=Element14; ComponentLink2Description: https://datasheet.ciiva.com/46394/1018594-46394951.pdf?src-supplier=Element14; ComponentLink3URL: https://datasheet.ciiva.com/16741/pyu-rc0402-51-rohs-l-6-r-16741081.pdf?src-supplier=Future+Electronics; ComponentLink3Description: https://datasheet.ciiva.com/16741/pyu-rc0402-51-rohs-l-6-r-16741081.pdf?src-supplier=Future+Electronics; ComponentLink4URL: https://datasheet.ciiva.com/7849/1018594-7849882.pdf?src-supplier=Element14; ComponentLink4Description: https://datasheet.ciiva.com/7849/1018594-7849882.pdf?src-supplier=Element14; ComponentLink5URL: https://datasheet.ciiva.com/7849/1018594-7849883.pdf?src-supplier=Element14; ComponentLink5Description: https://datasheet.ciiva.com/7849/1018594-7849883.pdf?src-supplier=Element14; Supplier Part Number 1: 311-1.00MLRCT-ND; Supplier 2: Mouser; Supplier Part Number 2: 603-RC0402FR-071ML
R49 R111 = RC0402FR-07100KL: RES SMD 100K OHM 1% 1/16W 0402; Manufacturer 1: Yageo; Power Rating: 63mW; Resistance: 100kR; Temperature Coefficient: 100ppm/°C; Voltage Rating: 50V; Supplier 1: Digi-Key; Manufacturer Part Number 1: RC0402FR-07100KL; Stock 1: 50867324; Pricing 1: 1=0.10000, 10=0.01500, 100=0.00600, 1000=0.00270, 2500=0.00235, 5000=0.00194 (USD); RoHS: Yes; Case/Package: 0402; Case Code (Metric): 1005; Case Code (Imperial): 0402; Min Operating Temperature: -55°C; Max Operating Temperature: 155°C; Tolerance: 1%; Packaging: Tape and Reel; Composition: Thick Film; Termination: SMD/SMT; Military Standard: Not; Package Quantity: 1; Number of Terminations: 2; Max Power Dissipation: 63mW; Features: Moisture Resistant; Working Voltage: 50V; Length: 0.039inch; Height: 0.016inch; Width: 0.02inch; Depth: 0.5mm; Lead Free: Lead Free; REACH SVHC: No SVHC; ComponentLink1URL: https://datasheet.ciiva.com/11819/0900766b80c66297-11819452.pdf?src-supplier=RSComponents; ComponentLink1Description: https://datasheet.ciiva.com/11819/0900766b80c66297-11819452.pdf?src-supplier=RSComponents; ComponentLink2URL: https://datasheet.ciiva.com/2453/pyu-r-int-thick-7-2453361.pdf?src-supplier=Digi-Key; ComponentLink2Description: https://datasheet.ciiva.com/2453/pyu-r-int-thick-7-2453361.pdf?src-supplier=Digi-Key; ComponentLink3URL: https://datasheet.ciiva.com/2453/pyu-r-int-thick-7-2453362.pdf?src-supplier=Digi-Key; ComponentLink3Description: https://datasheet.ciiva.com/2453/pyu-r-int-thick-7-2453362.pdf?src-supplier=Digi-Key; ComponentLink4URL: https://datasheet.ciiva.com/2453/pyu-r-int-thick-7-2453363.pdf?src-supplier=Digi-Key; ComponentLink4Description: https://datasheet.ciiva.com/2453/pyu-r-int-thick-7-2453363.pdf?src-supplier=Digi-Key; ComponentLink5URL: https://datasheet.ciiva.com/22747/1018594-22747509.pdf?src-supplier=Element14; ComponentLink5Description: https://datasheet.ciiva.com/22747/1018594-22747509.pdf?src-supplier=Element14; ComponentLink6URL: https://datasheet.ciiva.com/15189/getdatasheetpartid-323696-15189334.pdf?src-supplier=Verical; ComponentLink6Description: https://datasheet.ciiva.com/15189/getdatasheetpartid-323696-15189334.pdf?src-supplier=Verical; ComponentLink7URL: https://datasheet.ciiva.com/12667/pyu-rc0402-51-rohs-l-6-r-12667930.pdf?src-supplier=Mouser; ComponentLink7Description: https://datasheet.ciiva.com/12667/pyu-rc0402-51-rohs-l-6-r-12667930.pdf?src-supplier=Mouser; Supplier 2: Newark; Supplier 3: Mouser; Supplier Part Number 1: 311-100KLRCT-ND; Supplier Part Number 2: 67R9887; Supplier Part Number 3: 603-RC0402FR-07100KL
R102 R103 = CRCW0402470RFKED: RES SMD 470 OHM 1% 1/16W 0402; Manufacturer 1: Vishay; Temperature Coefficient: 100ppm/°C; Power Rating: 63mW; Voltage Rating: 50V; Manufacturer Part Number 1: CRCW0402470RFKED; Supplier 1: Digi-Key; Stock 1: 9199; Pricing 1: 1=0.10000, 10=0.03800, 100=0.01540, 1000=0.00690, 2500=0.00599, 5000=0.00495 (USD); RoHS: Yes; Mount: Surface Mount; Case/Package: 0402; Weight: 2.3E-05oz; Case Code (Imperial): 0402; Case Code (Metric): 1005; Contact Plating: Tin; Min Operating Temperature: -55°C; Max Operating Temperature: 155°C; Resistance: 470R; Tolerance: 1%; Composition: Thick Film; Packaging: Tape and Reel; Voltage Rating (DC): 50V; Termination: SMD/SMT; Number of Terminations: 2; Package Quantity: 10; Military Standard: Not; Max Power Dissipation: 63mW; Features: Automotive AEC-Q200; Length: 1mm; Height: 0.35mm; Width: 0.5mm; Depth: 0.5mm; Radiation Hardening: No; REACH SVHC: Unknown; Lead Free: Lead Free; ComponentLink1URL: https://datasheet.ciiva.com/11811/0900766b80d98824-11811416.pdf?src-supplier=RSComponents; ComponentLink1Description: https://datasheet.ciiva.com/11811/0900766b80d98824-11811416.pdf?src-supplier=RSComponents; ComponentLink2URL: https://datasheet.ciiva.com/16764/70201119-16764886.pdf?src-supplier=Allied+Electronics; ComponentLink2Description: https://datasheet.ciiva.com/16764/70201119-16764886.pdf?src-supplier=Allied+Electronics; ComponentLink3URL: https://datasheet.ciiva.com/28613/1720486-28613479.pdf?src-supplier=Element14; ComponentLink3Description: https://datasheet.ciiva.com/28613/1720486-28613479.pdf?src-supplier=Element14; ComponentLink4URL: https://datasheet.ciiva.com/3256/dcrcwe3-3256553.pdf?src-supplier=Avnet; ComponentLink4Description: https://datasheet.ciiva.com/3256/dcrcwe3-3256553.pdf?src-supplier=Avnet; ComponentLink5URL: https://datasheet.ciiva.com/7777/1720486-7777243.pdf?src-supplier=Element14; ComponentLink5Description: https://datasheet.ciiva.com/7777/1720486-7777243.pdf?src-supplier=Element14; ComponentLink6URL: https://datasheet.ciiva.com/8336/dcrcwe3-8336715.pdf?src-supplier=Avnet; ComponentLink6Description: https://datasheet.ciiva.com/8336/dcrcwe3-8336715.pdf?src-supplier=Avnet; ComponentLink7URL: https://datasheet.ciiva.com/7777/1697337-7777244.pdf?src-supplier=Element14; ComponentLink7Description: https://datasheet.ciiva.com/7777/1697337-7777244.pdf?src-supplier=Element14; ComponentLink8URL: https://datasheet.ciiva.com/2463/dcrcwe3-2463085.pdf?src-supplier=Digi-Key; ComponentLink8Description: https://datasheet.ciiva.com/2463/dcrcwe3-2463085.pdf?src-supplier=Digi-Key; ComponentLink9URL: https://datasheet.ciiva.com/16362/dcrcwe3-16362109.pdf?src-supplier=Future+Electronics; ComponentLink9Description: https://datasheet.ciiva.com/16362/dcrcwe3-16362109.pdf?src-supplier=Future+Electronics; ComponentLink10URL: https://datasheet.ciiva.com/16882/dcrcwe3-16882493.pdf?src-supplier=Avnet+Europe; ComponentLink10Description: https://datasheet.ciiva.com/16882/dcrcwe3-16882493.pdf?src-supplier=Avnet+Europe; ComponentLink11URL: https://datasheet.ciiva.com/2463/dcrcwe3-2463086.pdf?src-supplier=Digi-Key; ComponentLink11Description: https://datasheet.ciiva.com/2463/dcrcwe3-2463086.pdf?src-supplier=Digi-Key; ComponentLink12URL: https://datasheet.ciiva.com/2463/dcrcwe3-2463087.pdf?src-supplier=Digi-Key; ComponentLink12Description: https://datasheet.ciiva.com/2463/dcrcwe3-2463087.pdf?src-supplier=Digi-Key; Supplier 2: Newark; Supplier Part Number 1: 541-470LCT-ND; Supplier Part Number 2: 26W9133
R110 = RC0402FR-07332RL: RES SMD 332 OHM 1% 1/16W 0402; Manufacturer 1: Yageo; Temperature Coefficient: 100ppm/°C; Power Rating: 62.5mW; Voltage Rating: 50V; Manufacturer Part Number 1: RC0402FR-07332RL; Supplier 1: Digi-Key; Stock 1: 2789251; Pricing 1: 1=0.10000, 10=0.01600, 100=0.00640, 1000=0.00289, 2500=0.00251, 5000=0.00207 (USD); RoHS: Yes; Case/Package: 0402; Weight: 2.3E-05oz; Case Code (Imperial): 0402; Case Code (Metric): 1005; Min Operating Temperature: -55°C; Max Operating Temperature: 155°C; Packaging: Tape and Reel; Resistance: 332R; Tolerance: 1%; Composition: Thick Film; Voltage Rating (DC): 50V; Termination: SMD/SMT; Military Standard: Not; Length: 1mm; Height: 0.35mm; Width: 0.5mm; Depth: 0.5mm; Lead Free: Lead Free; ComponentLink1URL: https://datasheet.ciiva.com/16929/pyu-rc0402-51-rohs-l-6-r-16929351.pdf?src-supplier=Future+Electronics; ComponentLink1Description: https://datasheet.ciiva.com/16929/pyu-rc0402-51-rohs-l-6-r-16929351.pdf?src-supplier=Future+Electronics; Supplier 2: Mouser; Supplier Part Number 1: 311-332LRCT-ND; Supplier Part Number 2: 603-RC0402FR-07332RL
U6 = MIC2076-2YM: Power Supply Support Circuit, Fixed, 2 Channel, 2.4, PDSO8; Manufacturer 1: Microchip; Supplier 1: Digi-Key; Manufacturer Part Number 1: MIC2076-2YM; RoHS: Yes; Category: Hot Swap Controllers; Stock 1: 106; Pricing 1: 1=1,26000, 25=1,06000, 100=0,97000 (USD)
U13 = CMP-035-000000-5: USB Host Controller USB 3.0 USB Interface 68-QFN (8x8); Manufacturer 1: Renesas Electronics; Design Item ID: UPD720201K8-701-BAC-A; Check_prices: https://www.snapeda.com/parts/UPD720201K8-701-BAC-A/Renesas%20Electronics%20America/view-part/2753309/?ref=eda; Manufacturer Part Number 1: UPD720201K8-701-BAC-A; Value: *; Digi-Key_Part_Number: UPD720201K8-701-BAC-A-ND; SnapEDA_Link: https://www.snapeda.com/parts/UPD720201K8-701-BAC-A/Renesas%20Electronics%20America/view-part/2753309/?ref=snap; Component Type: Standard; Source: UPD720201K8-701-BAC-A.SchLib; Supplier 1: Mouser; Pin Count: 69; Package: QFN-68 Renesas; Supplier Part Number 1: 968-D720201K8701BACA
Y2 = CMP-003-00028-2: Crystal, 24 MHz, +/- 10 ppm, -20 to 75 degC, 4-Pin SMD, RoHS, Tape and Reel; Manufacturer 1: Epson; Load Capacitance: 12pF; Frequency: 24MHz; ESR: 80; Mounting Technology: SMT; Pins: 4; Case/Package: SMD/SMT; Min Operating Temperature: -20°C; RoHS Compliant: Yes; Max Operating Temperature: 75°C; Manufacturer Part Number 1: FA-128 24.0000MF10Z-W3; Supplier 1: Digikey; Supplier Part Number 1: SER3678TR-ND